# Altium schematic sheet WallPhish.SchDoc
size B; SheetNumber: 1; SheetTotal: 1
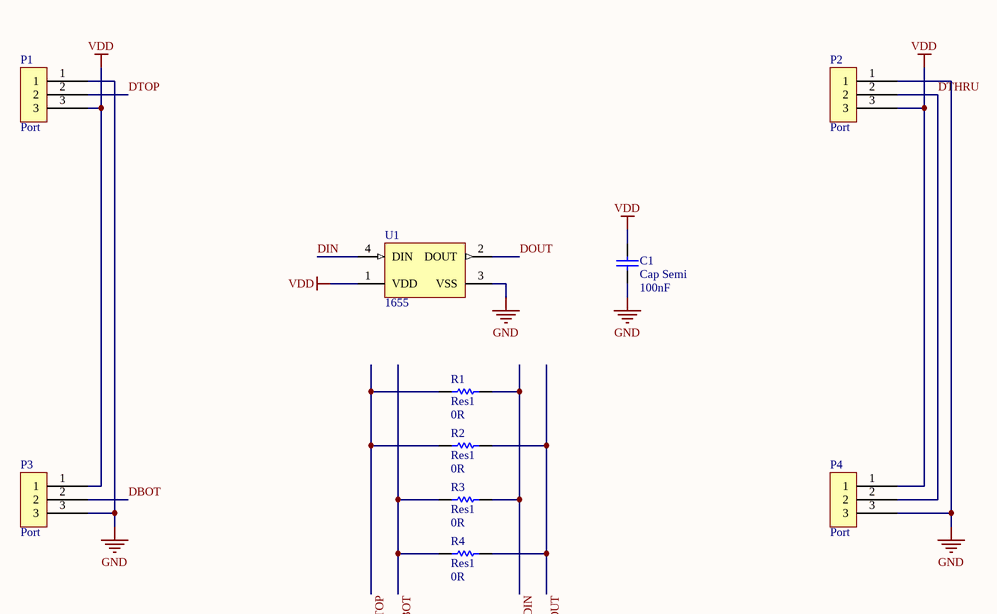
[diagram p0: WallPhish.SchDoc]

## Parts
C1  Cap Semi  value 100nF  [C1206]
P1  Port  [Port-3wire]
P2  Port  [Port-3wire]
P3  Port  [Port-3wire]
P4  Port  [Port-3wire]
R1  Res1  value 0R  [C1206]
R2  Res1  value 0R  [C1206]
R3  Res1  value 0R  [C1206]
R4  Res1  value 0R  [C1206]
U1  1655  [ADA-RGB-1655_V]

## Nets
GND: C1.1 P1.1 P2.1 P3.3 P4.3 U1.3(VSS)
VDD: C1.2 P1.3 P2.3 P3.1 P4.1 U1.1(VDD)
DBOT: P3.2 R3.1 R4.1
DIN: R1.2 R3.2 U1.4(DIN)
DOUT: R2.2 R4.2 U1.2(DOUT)
DTHRU: P2.2 P4.2
DTOP: P1.2 R1.1 R2.1

## Library data of the parts
C1 = Cap Semi: Capacitor (Semiconductor SIM Model); Published: 8-Jun-2000; LatestRevisionDate: 29-May-2009; LatestRevisionNote: IPC-7351 Footprint Added.; PackageReference: C1206; Publisher: Altium Limited; PackageDescription: Chip Capacitor
P1-P4 = Port: 3-wire port
R1-R4 = Res1: Resistor; Published: 8-Jun-2000; LatestRevisionDate: 17-Jul-2002; LatestRevisionNote: Re-released for DXP Platform.; PackageReference: AXIAL-0.3; Publisher: Altium Limited; PackageDescription: Axial Device, Thru-Hole; 2 Leads; 0.3 in Pin Spacing
U1 = CMP-2000-05026-1: Intelligent Control LED Integrated Light Source, 3.5 to 5.3 V, -25 to 80 degC, 4-Pin SMD, RoHS, Tape and Reel; Manufacturer: Adafruit-Industries-LLC; Number of LEDs: 10; Configuration: Discrete; Utilized LED: WS2812(5050); Datasheet URL: http://datasheet.octopart.com/ADA1655-Adafruit-Industries-datasheet-32028139.pdf; Series: Neopixel; Interface: -; Package Description: 4-Pin Surface Mount Device, Body 5 x 5 mm; Color: Red,Green,Blue(RGB); Category: Optoelectronics; Controller Type: -; Package Reference: 1655; Manufacturer URL: https://www.adafruit.com/; Mounting Type: SurfaceMount; Datasheet Version: May-13; Size / Dimension: 5.00mmLx5.00mmW; Family: Addressable,Specialty